# Altium schematic sheet ESP12_interface.SchDoc
size A4
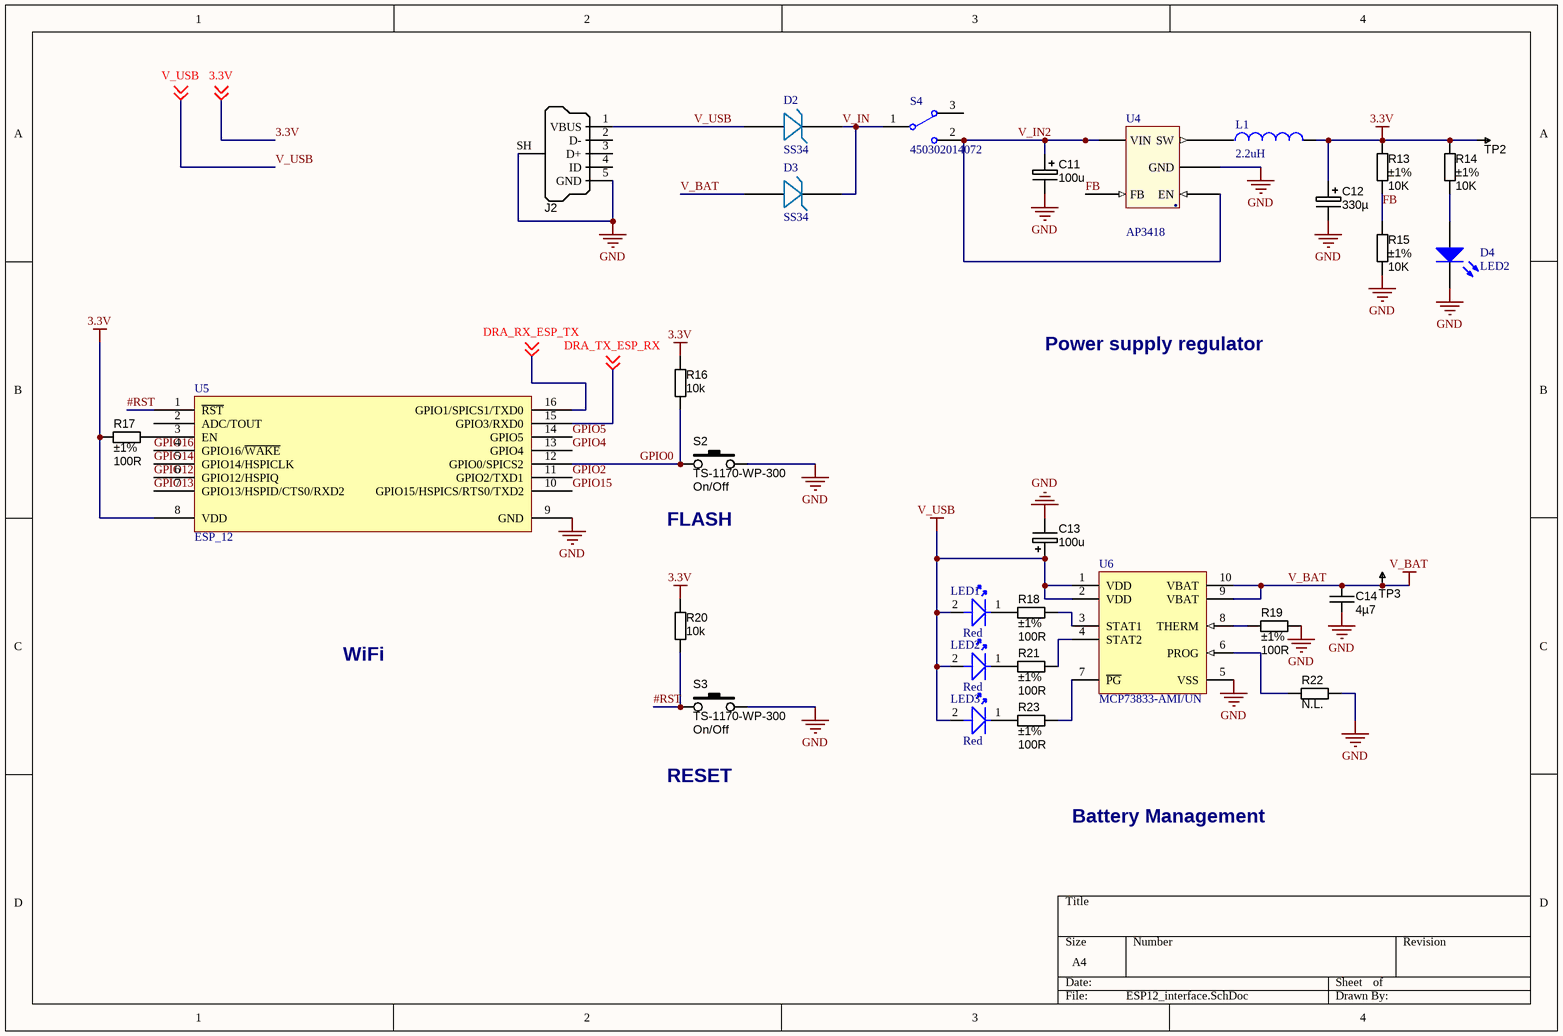
[diagram p0: ESP12_interface.SchDoc]

## Parts
C11  100u  [CAPMP7343X310N]
C12  330µ  [CAPMP7343X310N]
C13  100u  [CAPMP7343X310N]
C14  value 4µ7  [CAPC2012X135N]  (hidden comment: approved sub OK)
D2  SS34  [DO-214AB]
D3  SS34  [DO-214AB]
D4  LED2  [3.2X1.6X1.1]
J2  USB Micro Type B (recommended if hand soldering)  [USB_Micro-B_FCI_SMD]  (value not drawn)
L1  value 2.2uH  [Inductor 6.8uH Shielded]  (hidden comment: SRN6045)
LED1  Red  [Type 3mm]
LED2  Red  [Type 3mm]
LED3  Red  [Type 3mm]
R13  value 10K  Tolerance: ±1%  [RESC2012X70N]  (hidden comment: Thick Film)
R14  value 10K  Tolerance: ±1%  [RESC2012X70N]  (hidden comment: Thick Film)
R15  value 10K  Tolerance: ±1%  [RESC2012X70N]  (hidden comment: Thick Film)
R16  value 10k  [ERA-0805]  (hidden comment: Jumper)
R17  value 100R  Tolerance: ±1%  [RESC2012X70N]  (hidden comment: Thick Film)
R18  value 100R  Tolerance: ±1%  [RESC2012X70N]  (hidden comment: Thick Film)
R19  value 100R  Tolerance: ±1%  [RESC2012X70N]  (hidden comment: Thick Film)
R20  value 10k  [ERA-0805]  (hidden comment: Jumper)
R21  value 100R  Tolerance: ±1%  [RESC2012X70N]  (hidden comment: Thick Film)
R22  value N.L.  [RESC2012X70N]  (hidden comment: RES_NL_0805)  (no BOM)
R23  value 100R  Tolerance: ±1%  [RESC2012X70N]  (hidden comment: Thick Film)
S2  Manufacturer Part Number 1: TS-1170-WP-300  Function: On/Off  [TACT-SWITCH-TS1170]  (hidden comment: SW_THT_PB_7.0mm)
S3  Manufacturer Part Number 1: TS-1170-WP-300  Function: On/Off  [TACT-SWITCH-TS1170]  (hidden comment: SW_THT_PB_7.0mm)
S4  450302014072  [450302014072]
TP2  TESTPOINT  [TP-R60]  (value not drawn)  (no BOM)
TP3  TESTPOINT  [TP-R60]  (value not drawn)  (no BOM)
U4  AP3418  [SOT23-5]
U5  ESP_12  [ESP_12]
U6  MCP73833-AMI/UN  [MSOP-UN10_N]

## Nets
3.3V: C12.1 L1.2 R13.1 R14.1 R16.1 R17.1 R20.1 TP2.1 U5.8(VDD) ; off-sheet 3.3V
GND: C11.2 C12.2 C13.2 C14.2 D4.2(K) J2.5(GND) J2.SH(Shell) R15.2 R19.2 R22.2 S2.2 S3.2 U4.2(GND) U5.9(GND) U6.5(VSS)
V_BAT: C14.1 D3.A TP3.1 U6.9(VBAT) U6.10(VBAT)
V_USB: C13.1 D2.A J2.1(VBUS) LED1.2(A) LED2.2(A) LED3.2(A) U6.1(VDD) U6.2(VDD) ; off-sheet V_USB
#RST: R20.2 S3.1 U5.1(~{RST})
DRA_RX_ESP_TX: U5.16(GPIO1/SPICS1/TXD0) ; off-sheet DRA_RX_ESP_TX
DRA_TX_ESP_RX: U5.15(GPIO3/RXD0) ; off-sheet DRA_TX_ESP_RX
FB: R13.2 R15.1 U4.5(FB)
GPIO0: R16.2 S2.1 U5.12(GPIO0/SPICS2)
GPIO2: U5.11(GPIO2/TXD1)
GPIO4: U5.13(GPIO4)
GPIO5: U5.14(GPIO5)
GPIO12: U5.6(GPIO12/HSPIQ)
GPIO13: U5.7(GPIO13/HSPID/CTS0/RXD2)
GPIO14: U5.5(GPIO14/HSPICLK)
GPIO15: U5.10(GPIO15/HSPICS/RTS0/TXD2)
GPIO16: U5.4(GPIO16/~{WAKE})
V_IN: D2.K D3.K S4.1
V_IN2: C11.1 S4.2 U4.1(EN) U4.4(VIN)
NetD4_1: D4.1(A) R14.2
NetL1_1: L1.1 U4.3(SW)
NetLED1_1: LED1.1(K) R18.1
NetLED2_1: LED2.1(K) R21.1
NetLED3_1: LED3.1(K) R23.1
NetR17_2: R17.2 U5.3(EN)
NetR18_2: R18.2 U6.3(STAT1)
NetR19_1: R19.1 U6.8(THERM)
NetR21_2: R21.2 U6.4(STAT2)
NetR22_1: R22.1 U6.6(PROG)
NetR23_2: R23.2 U6.7(~{PG})

Not connected (* = marked no-connect by the designer): J2 2(D-) 3(D+) 4(ID); S4 3; U5 2(ADC/TOUT)

## Notes on the sheet
- Power supply regulator
- (near S2) FLASH
- WiFi
- RESET
- Battery Management
- (in symbol AP3418) .

## Library data of the parts
C11-C13 = CAPT_330u_2917_6V3: Capacitor SMD Tant 330uF 20% 6V3 2917; Manufacturer Size Code: D; Manufacturer Part Number: T520D337M006ATE015; Ratings: 6.3V; Material: Solid Tantalum; ESR (Equivalent Series Resistance): 15 mOhm; SCDType: spec; Package / Case: 2917 (7343 Metric); Tolerance: ±20%; Operating Temperature: -55°C ~ 125°C; Size / Dimension: 0.287" L x 0.169" W (7.30mm x 4.30mm); Height - Seated (Max): 0.122" (3.10mm); Supplier 1: Digi-Key; Supplier Part Number 1: 399-4052-1-ND; ComponentLink1URL: http://www.kemet.com/datasheets&T520D337M006ATE015; ComponentLink1Description: T520D Datasheet
  C11 C13: Value: 100u
  C12: Value: 330µ
C14 = CAPC_4u7_0805: Capacitor SMD Cer 4.7uF 10% 16V X5R 0805; Manufacturer 1: Taiyo Yuden; Manufacturer Part Number 1: EMK212BJ475KG-T; Ratings: 16V; X5R; Material: ceramic; SCDType: spec; Package / Case: 0805 (2012 Metric); Tolerance: ±10%; Supplier 1: Digi-Key; Supplier Part Number 1: 587-1294-1-ND; Operating Temperature: -55°C ~ 85°C; Size / Dimension: 0.079" L x 0.049" W (2.00mm x 1.25mm); Thickness (Max): 0.053" (1.35mm); ComponentLink1URL: http://www.yuden.co.jp/productdata/catalog/en/mlcc01_e.pdf; ComponentLink1Description: http://www.yuden.co.jp/productdata/catalog/en/mlcc01_e.pdf; Supplier 2: Digi-Key; Supplier Part Number 2: 1276-1065-1-ND; Manufacturer 2: Samsung Electro-Mechanics America, Inc; Manufacturer Part Number 2: CL21A475KOFNNNE; RoHS 2: RoHS Compliant; ComponentLink2URL: http://www.samsungsem.com/servlet/FileDownload?type=spec&file=CL21A475KOFNNNE.pdf; ComponentLink2Description: http://www.samsungsem.com/servlet/FileDownload?type=spec&file=CL21A475KOFNNNE.pdf; Supplier 3: Digi-Key; Supplier Part Number 3: 399-8101-1-ND; Manufacturer 3: Kemet; Manufacturer Part Number 3: C0805C475K4PACTU; RoHS 3: RoHS Compliant; ComponentLink3URL: http://capacitoredge.kemet.com/capedge2/DataSheet?pn=C0805C475K4PACTU; ComponentLink3Description: http://capacitoredge.kemet.com/capedge2/DataSheet?pn=C0805C475K4PACTU; Supplier 4: Digi-Key; Supplier Part Number 4: 490-7215-1-ND; Manufacturer 4: Murata Electronics North America; Manufacturer Part Number 4: GRM21BR61C475MA88L; RoHS 4: RoHS Compliant; ComponentLink4URL: http://psearch.murata.com/capacitor/product/GRM21BR61C475MA88#.pdf; ComponentLink4Description: http://psearch.murata.com/capacitor/product/GRM21BR61C475MA88#.pdf; Supplier 5: Digi-Key; Supplier Part Number 5: 445-7640-1-ND; Manufacturer 5: TDK Corporation; Manufacturer Part Number 5: C2012X5R1C475K125AC; RoHS 5: RoHS Compliant; ComponentLink5URL: http://product.tdk.com/capacitor/mlcc/en/documents/mlcc_commercial_general_en.pdf; ComponentLink5Description: http://product.tdk.com/capacitor/mlcc/en/documents/mlcc_commercial_general_en.pdf; RoHS 1: RoHS Compliant
D2 D3 = SS34 Schotkey Diode
D4 = LED2: Typical RED, GREEN, YELLOW, AMBER GaAs LED; Published: 8-Jun-2000; LatestRevisionDate: 17-Jul-2002; LatestRevisionNote: Re-released for DXP Platform.; PackageVersion: Feb-2002; PackageReference: 3.2X1.6X1.1; Publisher: Altium Limited; PackageDescription: SM LED; 2 Flat Leads
J2 = USB_Micro_TypeB_FCI: Connector SMD-THD USB Micro Type B middle mount; Manufacturer 1: FCI; Manufacturer Part Number 1: 10103593-0001LF; SCDType: undef; Package / Case: SMD/THD mid-mount; Supplier 1: Digi-Key; Supplier Part Number 1: 609-4049-1-ND
L1 = Bourns Shielded inductor: SRN6045 shielded inductor
LED1-LED3 = WL-TMRW, Type 3mm, 151031YS06000: THT LED round mono-color color lens, WL-TMRW, Yellow; Manufacturer: Würth Elektronik eiSos GmbH; PartNo: 151031YS06000; ComponentLink1Description: Manufacturer; ComponentLink1URL: http://www.we-online.de; Created by: Christin Otto; Created Date: Oct-2014; ComponentLink2Description: Datasheet; ComponentLink2URL: http://katalog.we-online.de/pbs/datasheet/7448042001.pdfhttp://katalog.we-online.de/pbs/datasheet/7448042001.pdfhttp://katalog.we-online.de/pbs/datasheet/7448042001.pdfhttp://katalog.we-online.de/pbs/datasheet/151031YS06000.pdf; Emitting color: Yellow
R13-R15 = RES_10K_0805_1%: Resistor SMD chip 10k Ohm 0.125W 1% 0805; Manufacturer 1: Vishay/Dale; Manufacturer Part Number 1: CRCW080510K0FKEA; Ratings: 1/8W; SCDType: spec; Package / Case: 0805 (2012 metric); Supplier 1: Digi-Key; Supplier Part Number 1: 541-10.0KCCT-ND; Material: Thick Film
R16 R20 = RES_0R_0805: Resistor SMD chip 0.0 Ohm 0.125W 0805; Manufacturer 1: Samsung Electro-Mechanics America, Inc; Manufacturer Part Number 1: RC2012J000CS; Ratings: 1/8W; SCDType: spec; Tolerance: N/A; Package / Case: 0805 (2012 metric); Supplier 1: Digi-Key; Supplier Part Number 1: 1276-5466-6-ND; RoHS 1: RoHS Compliant; ComponentLink1URL: http://www.samsungsem.com/servlet/FileDownload?filename=productcatalog/pdf/Chip_Resistor.pdf; ComponentLink1Description: http://www.samsungsem.com/servlet/FileDownload?filename=productcatalog/pdf/Chip_Resistor.pdf; Supplier 2: Digi-Key; Supplier Part Number 2: RMCF0805ZT0R00DKR-ND; Manufacturer 2: Stackpole Electronics Inc; Manufacturer Part Number 2: RMCF0805ZT0R00; RoHS 2: RoHS Compliant; ComponentLink2URL: http://www.seielect.com/Catalog/SEI-RMCF_RMCP.pdf; ComponentLink2Description: http://www.seielect.com/Catalog/SEI-RMCF_RMCP.pdf; Supplier 3: Digi-Key; Supplier Part Number 3: 311-0.0ARDKR-ND; Manufacturer 3: Yageo; Manufacturer Part Number 3: RC0805JR-070RL; RoHS 3: RoHS Compliant; ComponentLink3URL: http://media.digikey.com/pdf/Data%20Sheets/Yageo%20PDFs/RC0805%20Pb%20Free.pdf; ComponentLink3Description: http://media.digikey.com/pdf/Data%20Sheets/Yageo%20PDFs/RC0805%20Pb%20Free.pdf; Supplier 4: Digi-Key; Supplier Part Number 4: P0.0ADKR-ND; Manufacturer 4: Panasonic Electronic Components; Manufacturer Part Number 4: ERJ-6GEY0R00V; RoHS 4: RoHS Compliant; ComponentLink4URL: http://industrial.panasonic.com/www-cgi/jvcr13pz.cgi?E+PZ+3+AOA0001+ERJ6GEY0R00V+7+WW; ComponentLink4Description: http://industrial.panasonic.com/www-cgi/jvcr13pz.cgi?E+PZ+3+AOA0001+ERJ6GEY0R00V+7+WW; Supplier 5: Digi-Key; Supplier Part Number 5: RHM0.0CPDKR-ND; Manufacturer 5: Rohm Semiconductor; Manufacturer Part Number 5: MCR10ERTJ000; RoHS 5: RoHS Compliant; ComponentLink5URL: http://rohmfs.rohm.com/en/products/databook/datasheet/passive/resistor/chip_resistor/mcr_g.pdf; ComponentLink5Description: http://rohmfs.rohm.com/en/products/databook/datasheet/passive/resistor/chip_resistor/mcr_g.pdf
R17-R19 R21 R23 = RES_100R_0805_1%: Resistor SMD chip 100 Ohm 0.125W 1% 0805; Manufacturer 1: Yageo; Manufacturer Part Number 1: RC0805FR-07100RL; Ratings: 1/8 W; SCDType: spec; Package / Case: 0805 (2012 Metric); Material: Thick Film; Supplier 1: Digi-Key; Supplier Part Number 1: 311-100CRCT-ND
R22 = RES_NL_0805: Resistor, SMD chip; Package / Case: 0805 (2012 metric)
S2 S3 = SW_THT_PB_7.0mm: Switch, tact, 7.0mm stem; Manufacturer 1: Bond-Tact; SCDType: source*; Package / Case: 6.5x6.5mm; 7.0mm stem; Material: Brass/Nylon/Ag plating
S4 = WS-SLTU, 450302014072: WS-SLTU 10x2.5 mm THT right angled; Manufacturer: Wurth Elektronik; partNo: 450302014072; ComponentLink1Description: Manufacturer; ComponentLink1URL: http://www.we-online.de; Created by: Baojun Chen; Created Date: Dec.2015; ComponentLink2Description: Datasheet; ComponentLink2URL: http://katalog.we-online.de/em/datasheet/450302014072.pdf
TP2 TP3 = TESTPOINT: SMD test pin
U4 = AP3418: DC/DC buck converter
U5 = ESP_12: ESP-12 Wi-Fi Module by AI-Thinker; IC: ESP8266-EX; Vendor: Ai-thinker
U6 = MCP73833-AMI/UN: Stand-Alone Linear Li-Ion/Li-Polymer Charge Management Controller with Power-Good Output, 4.2V, 10-Pin MSOP, Industrial Temperature; Published: 29-Jan-2009; LatestRevisionDate: 27-Nov-2009; LatestRevisionNote: Updated to datasheet revision B, May-2009; DatasheetVersion: revB, May-2009; PackageVersion: revBB, Aug-2009; PackageReference: MSOP-UN10; Publisher: Altium Limited; PackageDescription: 10-Lead Plastic Micro Small Outline Package (UN) [MSOP]; Supplier 1: Digi-Key; Supplier Part Number 1: MCP73833-AMI/UN-ND; Supplier 2: Farnell; Supplier Part Number 2: 1332160; ComponentLink1Description: Datasheet; ComponentLink1URL: http://ww1.microchip.com/downloads/en/DeviceDoc/22005b.pdf; ComponentLink2Description: Packaging Specification; ComponentLink2URL: http://www.microchip.com/stellent/groups/techpub_sg/documents/packagingspec/en012702.pdf; ComponentLink3Description: Microchip.com Home; ComponentLink3URL: http://www.microchip.com/